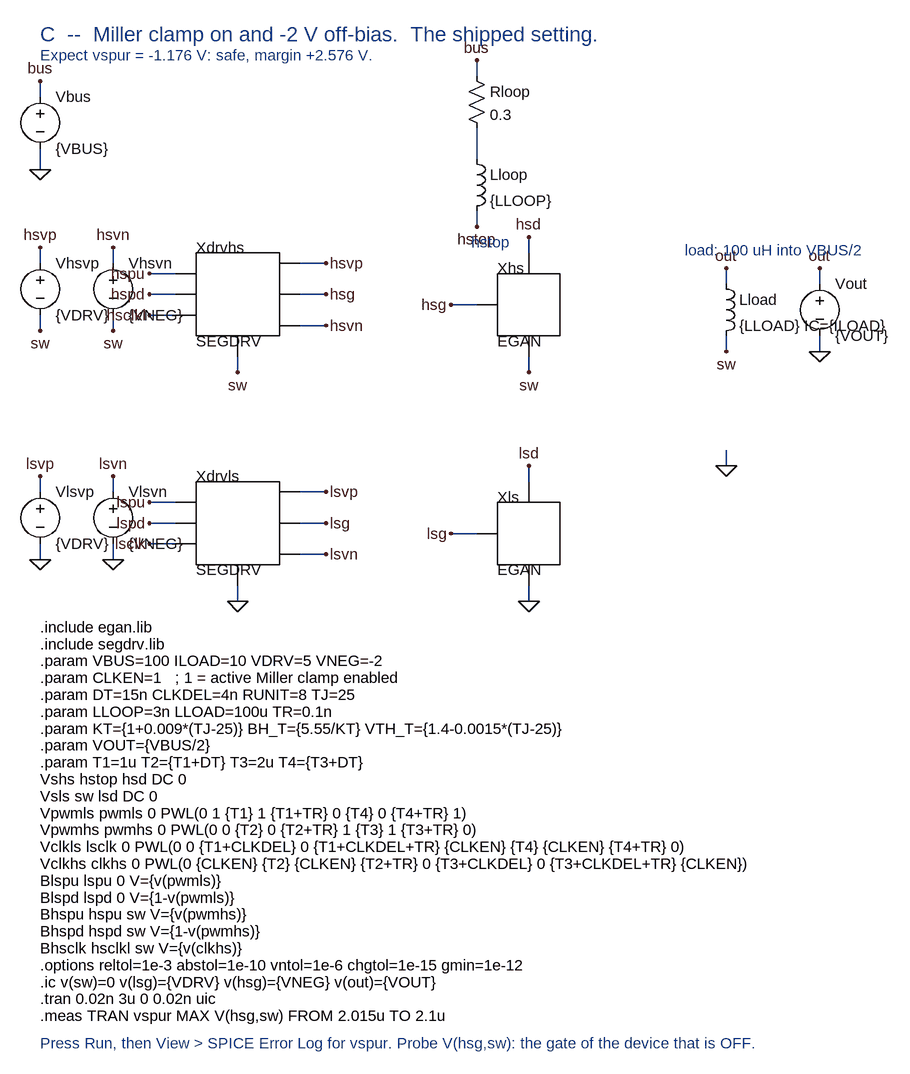
[diagram p0: schematic C_design_clamp_and_neg_bias.asc]
C_design_clamp_and_neg_bias.asc, the LTspice schematic file:
Version 4
SHEET 1 2000 1700
WIRE 96 144 96 120
WIRE 96 224 96 256
WIRE 768 112 768 88
WIRE 768 192 768 240
WIRE 768 320 768 344
WIRE 848 384 848 360
WIRE 768 464 728 464
WIRE 848 544 848 568
WIRE 304 416 264 416
WIRE 304 448 264 448
WIRE 304 480 264 480
WIRE 496 448 536 448
WIRE 496 400 536 400
WIRE 496 496 536 496
WIRE 400 544 400 568
WIRE 96 400 96 376
WIRE 96 480 96 504
WIRE 208 400 208 376
WIRE 208 480 208 504
WIRE 848 736 848 712
WIRE 768 816 728 816
WIRE 848 896 848 920
WIRE 304 768 264 768
WIRE 304 800 264 800
WIRE 304 832 264 832
WIRE 496 800 536 800
WIRE 496 752 536 752
WIRE 496 848 536 848
WIRE 400 896 400 920
WIRE 96 752 96 728
WIRE 96 832 96 856
WIRE 208 752 208 728
WIRE 208 832 208 856
WIRE 1152 432 1152 408
WIRE 1152 512 1152 536
WIRE 1296 432 1296 408
WIRE 1296 512 1296 536
WIRE 1152 688 1152 712
FLAG 96 120 bus
FLAG 96 256 0
FLAG 768 88 bus
FLAG 768 344 hstop
FLAG 848 360 hsd
FLAG 728 464 hsg
FLAG 848 568 sw
FLAG 264 416 hspu
FLAG 264 448 hspd
FLAG 264 480 hsclkl
FLAG 536 448 hsg
FLAG 536 400 hsvp
FLAG 536 496 hsvn
FLAG 400 568 sw
FLAG 96 376 hsvp
FLAG 96 504 sw
FLAG 208 376 hsvn
FLAG 208 504 sw
FLAG 848 712 lsd
FLAG 728 816 lsg
FLAG 848 920 0
FLAG 264 768 lspu
FLAG 264 800 lspd
FLAG 264 832 lsclk
FLAG 536 800 lsg
FLAG 536 752 lsvp
FLAG 536 848 lsvn
FLAG 400 920 0
FLAG 96 728 lsvp
FLAG 96 856 0
FLAG 208 728 lsvn
FLAG 208 856 0
FLAG 1152 408 out
FLAG 1152 536 sw
FLAG 1296 408 out
FLAG 1296 536 0
FLAG 1152 712 0
SYMBOL voltage 96 128 R0
SYMATTR InstName Vbus
SYMATTR Value {VBUS}
SYMBOL res 752 96 R0
SYMATTR InstName Rloop
SYMATTR Value 0.3
SYMBOL ind 752 224 R0
SYMATTR InstName Lloop
SYMATTR Value {LLOOP}
SYMBOL egan 800 416 R0
SYMATTR InstName Xhs
SYMATTR Value EGAN
SYMATTR SpiceLine vth={VTH_T} bh={BH_T}
SYMBOL segdrv 336 384 R0
SYMATTR InstName Xdrvhs
SYMATTR Value SEGDRV
SYMATTR SpiceLine npu=8 npd=8 runit={RUNIT} rclamp=0.5
SYMBOL voltage 96 384 R0
SYMATTR InstName Vhsvp
SYMATTR Value {VDRV}
SYMBOL voltage 208 384 R0
SYMATTR InstName Vhsvn
SYMATTR Value {VNEG}
SYMBOL egan 800 768 R0
SYMATTR InstName Xls
SYMATTR Value EGAN
SYMATTR SpiceLine vth={VTH_T} bh={BH_T}
SYMBOL segdrv 336 736 R0
SYMATTR InstName Xdrvls
SYMATTR Value SEGDRV
SYMATTR SpiceLine npu=8 npd=8 runit={RUNIT} rclamp=0.5
SYMBOL voltage 96 736 R0
SYMATTR InstName Vlsvp
SYMATTR Value {VDRV}
SYMBOL voltage 208 736 R0
SYMATTR InstName Vlsvn
SYMATTR Value {VNEG}
SYMBOL ind 1136 416 R0
SYMATTR InstName Lload
SYMATTR Value {LLOAD} IC={ILOAD}
SYMBOL voltage 1296 416 R0
SYMATTR InstName Vout
SYMATTR Value {VOUT}
TEXT 96 48 Left 3 ;C  --  Miller clamp on and -2 V off-bias.  The shipped setting.
TEXT 96 80 Left 2 ;Expect vspur = -1.176 V: safe, margin +2.576 V.
TEXT 760 368 Left 2 ;hstop
TEXT 1088 380 Left 2 ;load: 100 uH into VBUS/2
TEXT 96 960 Left 2 !.include egan.lib
TEXT 96 986 Left 2 !.include segdrv.lib
TEXT 96 1012 Left 2 !.param VBUS=100 ILOAD=10 VDRV=5 VNEG=-2
TEXT 96 1038 Left 2 !.param CLKEN=1   ; 1 = active Miller clamp enabled
TEXT 96 1064 Left 2 !.param DT=15n CLKDEL=4n RUNIT=8 TJ=25
TEXT 96 1090 Left 2 !.param LLOOP=3n LLOAD=100u TR=0.1n
TEXT 96 1116 Left 2 !.param KT={1+0.009*(TJ-25)} BH_T={5.55/KT} VTH_T={1.4-0.0015*(TJ-25)}
TEXT 96 1142 Left 2 !.param VOUT={VBUS/2}
TEXT 96 1168 Left 2 !.param T1=1u T2={T1+DT} T3=2u T4={T3+DT}
TEXT 96 1194 Left 2 !Vshs hstop hsd DC 0
TEXT 96 1220 Left 2 !Vsls sw lsd DC 0
TEXT 96 1246 Left 2 !Vpwmls pwmls 0 PWL(0 1 {T1} 1 {T1+TR} 0 {T4} 0 {T4+TR} 1)
TEXT 96 1272 Left 2 !Vpwmhs pwmhs 0 PWL(0 0 {T2} 0 {T2+TR} 1 {T3} 1 {T3+TR} 0)
TEXT 96 1298 Left 2 !Vclkls lsclk 0 PWL(0 0 {T1+CLKDEL} 0 {T1+CLKDEL+TR} {CLKEN} {T4} {CLKEN} {T4+TR} 0)
TEXT 96 1324 Left 2 !Vclkhs clkhs 0 PWL(0 {CLKEN} {T2} {CLKEN} {T2+TR} 0 {T3+CLKDEL} 0 {T3+CLKDEL+TR} {CLKEN})
TEXT 96 1350 Left 2 !Blspu lspu 0 V={v(pwmls)}
TEXT 96 1376 Left 2 !Blspd lspd 0 V={1-v(pwmls)}
TEXT 96 1402 Left 2 !Bhspu hspu sw V={v(pwmhs)}
TEXT 96 1428 Left 2 !Bhspd hspd sw V={1-v(pwmhs)}
TEXT 96 1454 Left 2 !Bhsclk hsclkl sw V={v(clkhs)}
TEXT 96 1480 Left 2 !.options reltol=1e-3 abstol=1e-10 vntol=1e-6 chgtol=1e-15 gmin=1e-12
TEXT 96 1506 Left 2 !.ic v(sw)=0 v(lsg)={VDRV} v(hsg)={VNEG} v(out)={VOUT}
TEXT 96 1532 Left 2 !.tran 0.02n 3u 0 0.02n uic
TEXT 96 1558 Left 2 !.meas TRAN vspur MAX V(hsg,sw) FROM 2.015u TO 2.1u
TEXT 96 1600 Left 2 ;Press Run, then View > SPICE Error Log for vspur. Probe V(hsg,sw): the gate of the device that is OFF.

The netlist it stands for:
* C_design_clamp_and_neg_bias.asc
Vbus bus 0 {VBUS}
Rloop bus N001 0.3
Lloop N001 hstop {LLOOP}
XXhs hsd hsg sw EGAN vth={VTH_T} bh={BH_T}  ; pins d g s
XXdrvhs hspu hspd hsclkl hsg hsvp hsvn sw SEGDRV npu=8 npd=8 runit={RUNIT} rclamp=0.5  ; pins pu pd clk out vp vn ref
Vhsvp hsvp sw {VDRV}
Vhsvn hsvn sw {VNEG}
XXls lsd lsg 0 EGAN vth={VTH_T} bh={BH_T}  ; pins d g s
XXdrvls lspu lspd lsclk lsg lsvp lsvn 0 SEGDRV npu=8 npd=8 runit={RUNIT} rclamp=0.5  ; pins pu pd clk out vp vn ref
Vlsvp lsvp 0 {VDRV}
Vlsvn lsvn 0 {VNEG}
Lload out sw {LLOAD} IC={ILOAD}
Vout out 0 {VOUT}
* C  --  Miller clamp on and -2 V off-bias.  The shipped setting.
* Expect vspur = -1.176 V: safe, margin +2.576 V.
* hstop
* load: 100 uH into VBUS/2
.include egan.lib
.include segdrv.lib
.param VBUS=100 ILOAD=10 VDRV=5 VNEG=-2
.param CLKEN=1   ; 1 = active Miller clamp enabled
.param DT=15n CLKDEL=4n RUNIT=8 TJ=25
.param LLOOP=3n LLOAD=100u TR=0.1n
.param KT={1+0.009*(TJ-25)} BH_T={5.55/KT} VTH_T={1.4-0.0015*(TJ-25)}
.param VOUT={VBUS/2}
.param T1=1u T2={T1+DT} T3=2u T4={T3+DT}
Vshs hstop hsd DC 0
Vsls sw lsd DC 0
Vpwmls pwmls 0 PWL(0 1 {T1} 1 {T1+TR} 0 {T4} 0 {T4+TR} 1)
Vpwmhs pwmhs 0 PWL(0 0 {T2} 0 {T2+TR} 1 {T3} 1 {T3+TR} 0)
Vclkls lsclk 0 PWL(0 0 {T1+CLKDEL} 0 {T1+CLKDEL+TR} {CLKEN} {T4} {CLKEN} {T4+TR} 0)
Vclkhs clkhs 0 PWL(0 {CLKEN} {T2} {CLKEN} {T2+TR} 0 {T3+CLKDEL} 0 {T3+CLKDEL+TR} {CLKEN})
Blspu lspu 0 V={v(pwmls)}
Blspd lspd 0 V={1-v(pwmls)}
Bhspu hspu sw V={v(pwmhs)}
Bhspd hspd sw V={1-v(pwmhs)}
Bhsclk hsclkl sw V={v(clkhs)}
.options reltol=1e-3 abstol=1e-10 vntol=1e-6 chgtol=1e-15 gmin=1e-12
.ic v(sw)=0 v(lsg)={VDRV} v(hsg)={VNEG} v(out)={VOUT}
.tran 0.02n 3u 0 0.02n uic
.meas TRAN vspur MAX V(hsg,sw) FROM 2.015u TO 2.1u
* Press Run, then View > SPICE Error Log for vspur. Probe V(hsg,sw): the gate of the device that is OFF.
.backanno
.end